# Altium schematic sheet Sheet3.SchDoc
size A; SheetNumber: 3; SheetTotal: 3
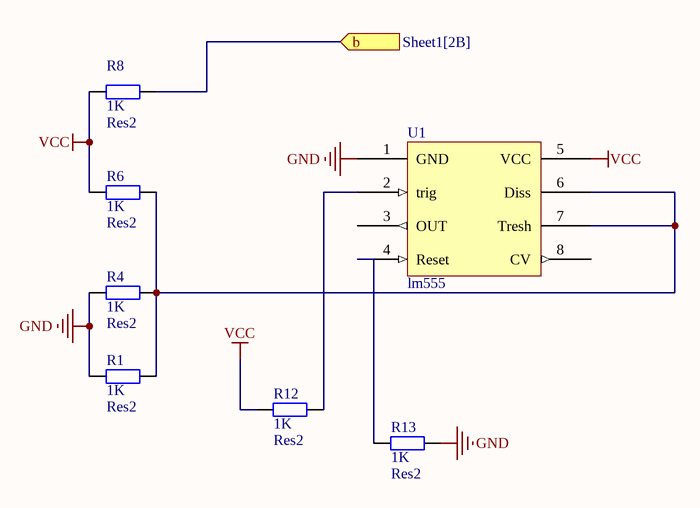
[diagram p0: Sheet3.SchDoc]

## Parts
R1  Res2  value 1K  [AXIAL-0.4]
R4  Res2  value 1K  [AXIAL-0.4]
R6  Res2  value 1K  [AXIAL-0.4]
R8  Res2  value 1K  [AXIAL-0.4]
R12  Res2  value 1K  [AXIAL-0.4]
R13  Res2  value 1K  [AXIAL-0.4]
U1  lm555  [DIP8]

## Ports
b (in, see Sheet1[2B])

## Nets
GND: R1.1 R4.1 R13.2 U1.1(GND)
VCC: R6.1 R8.1 R12.1 U1.5(VCC)
b: R8.2 ; port b
NetR1_2: R1.2 R4.2 R6.2 U1.6(Diss) U1.7(Tresh)
NetR12_2: R12.2 U1.2(trig)
NetR13_1: R13.1 U1.4(Reset)

Not connected (* = marked no-connect by the designer): U1 3(OUT) 8(CV)

## Library data of the parts
R1 R4 R6 R8 R12 R13 = Res2: Resistor; Published: 8-Jun-2000; LatestRevisionDate: 17-Jul-2002; LatestRevisionNote: Re-released for DXP Platform.; PackageReference: AXIAL-0.4; Publisher: Altium Limited; PackageDescription: Axial Device, Thru-Hole; 2 Leads; 0.4 in Pin Spacing